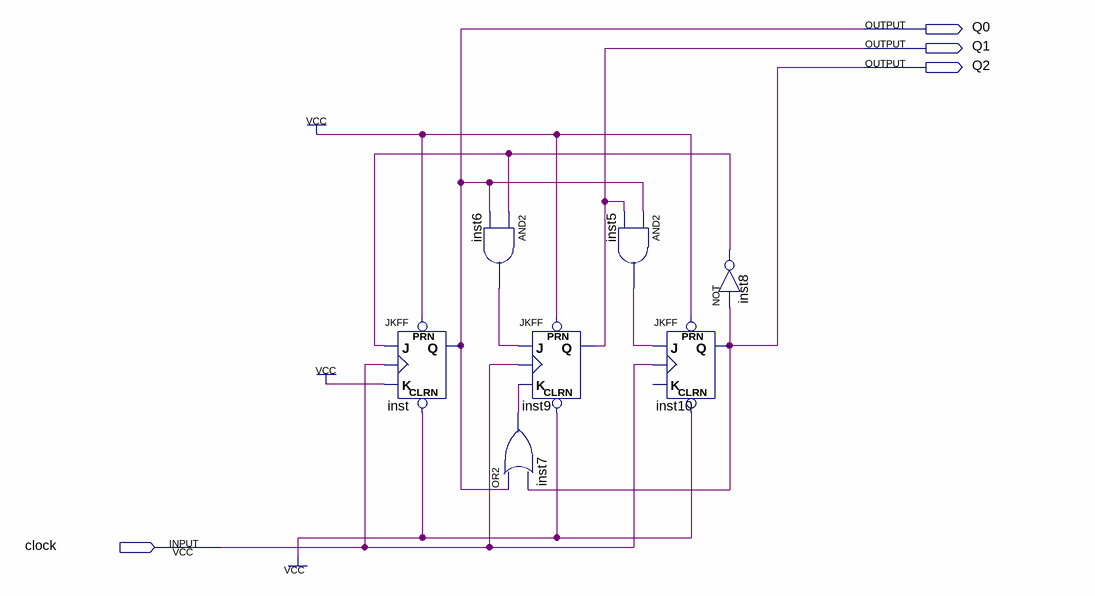
[diagram p0: schematic sheet]
// Quartus schematic sync_counter.bdf as structural Verilog: 7 symbols, 4 pins
module sync_counter (
  input  clock,
  output Q0,
  output Q1,
  output Q2
);

  wire inst5_out, inst6_out, inst7_out, inst8_out;

  JKFF inst (.PRN(1'b1), .CLRN(1'b1), .K(1'b1), .J(inst8_out), .CLK(clock), .Q(Q0));
  and inst6 (inst6_out, inst8_out, Q0);
  JKFF inst9 (.PRN(1'b1), .CLRN(1'b1), .K(inst7_out), .J(inst6_out), .CLK(clock), .Q(Q1));
  or inst7 (inst7_out, Q0, Q2);
  and inst5 (inst5_out, Q0, Q1);
  JKFF inst10 (.PRN(1'b1), .CLRN(1'b1), .J(inst5_out), .CLK(clock), .Q(Q2));  // open: K
  not inst8 (inst8_out, Q2);
endmodule
